# Altium schematic sheet AdcUnit.SchDoc
size A2
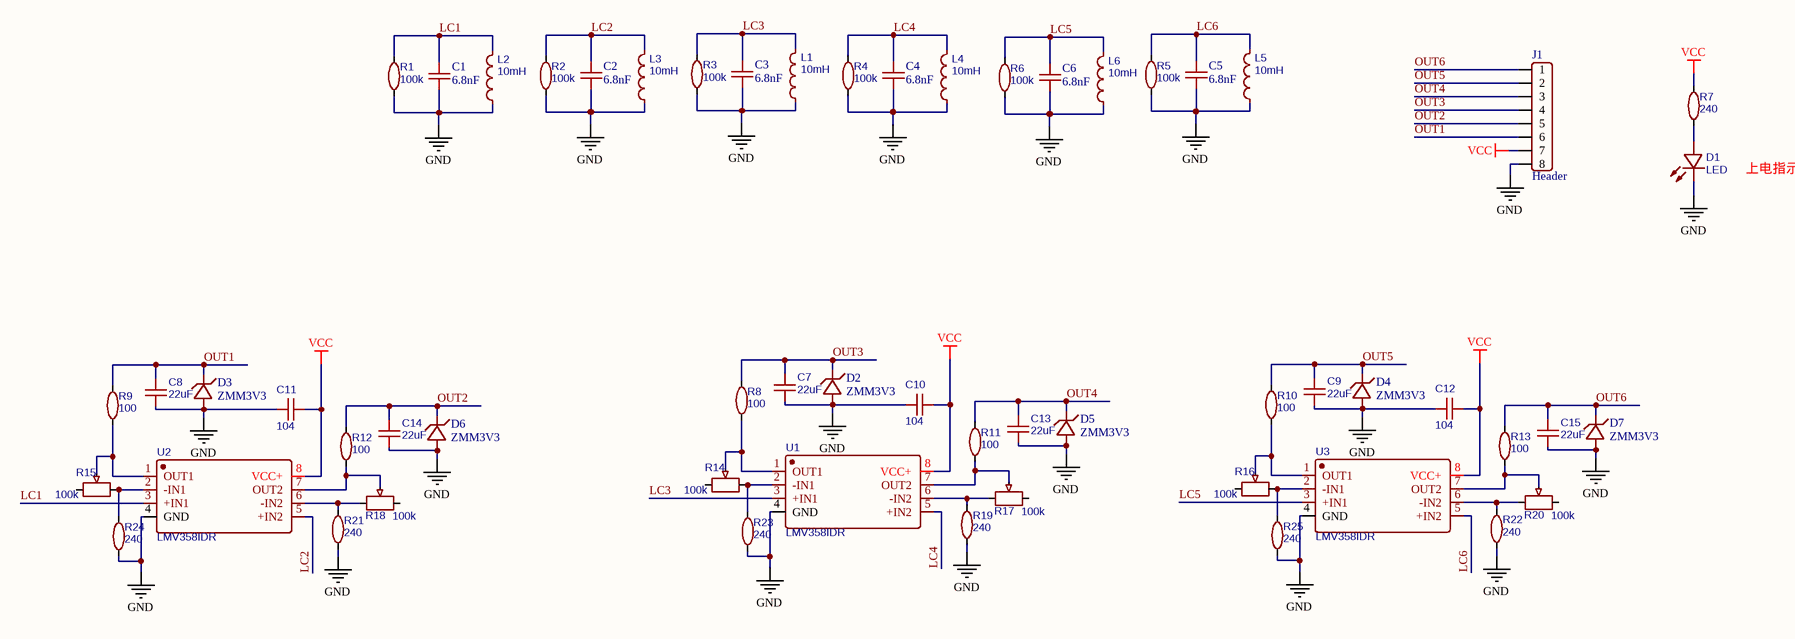
[diagram p0: AdcUnit.SchDoc]

## Parts
C1  6.8nF  [CAP3]
C2  6.8nF  [CAP3]
C3  6.8nF  [CAP3]
C4  6.8nF  [CAP3]
C5  6.8nF  [CAP3]
C6  6.8nF  [CAP3]
C7  22uF  [CAP_0603]
C8  22uF  [CAP_0603]
C9  22uF  [CAP_0603]
C10  104  [CAP_0603]
C11  104  [CAP_0603]
C12  104  [CAP_0603]
C13  22uF  [CAP_0603]
C14  22uF  [CAP_0603]
C15  22uF  [CAP_0603]
D1  LED  [LED_0603_B]
D2  ZMM3V3  [LL34]
D3  ZMM3V3  [LL34]
D4  ZMM3V3  [LL34]
D5  ZMM3V3  [LL34]
D6  ZMM3V3  [LL34]
D7  ZMM3V3  [LL34]
J1  Header  [Header 2.54X8]
L1  10mH  [Inductor_8x10]
L2  10mH  [Inductor_8x10]
L3  10mH  [Inductor_8x10]
L4  10mH  [Inductor_8x10]
L5  10mH  [Inductor_8x10]
L6  10mH  [Inductor_8x10]
R1  100k  [RES_0603]
R2  100k  [RES_0603]
R3  100k  [RES_0603]
R4  100k  [RES_0603]
R5  100k  [RES_0603]
R6  100k  [RES_0603]
R7  240  [RES_0603]
R8  100  [RES_0603]
R9  100  [RES_0603]
R10  100  [RES_0603]
R11  100  [RES_0603]
R12  100  [RES_0603]
R13  100  [RES_0603]
R14  100k  [RES_POT-3296W]
R15  100k  [RES_POT-3296W]
R16  100k  [RES_POT-3296W]
R17  100k  [RES_POT-3296W]
R18  100k  [RES_POT-3296W]
R19  240  [RES_0603]
R20  100k  [RES_POT-3296W]
R21  240  [RES_0603]
R22  240  [RES_0603]
R23  240  [RES_0603]
R24  240  [RES_0603]
R25  240  [RES_0603]
U1  LMV358IDR  [SOIC-8_150MIL]
U2  LMV358IDR  [SOIC-8_150MIL]
U3  LMV358IDR  [SOIC-8_150MIL]

## Nets
GND: C1.2 C2.2 C3.2 C4.2 C5.2 C6.2 C7.2 C8.2 C9.2 C10.1 C11.1 C12.1 C13.2 C14.2 C15.2 D1.C D2.1(A) D3.1(A) D4.1(A) D5.1(A) D6.1(A) D7.1(A) J1.8 L1.1 L2.1 L3.1 L4.1 L5.1 L6.1 R1.1 R2.1 R3.1 R4.1 R5.1 R6.1 R19.1 R21.1 R22.1 R23.1 R24.1 R25.1 U1.4(GND) U2.4(GND) U3.4(GND)
VCC: C10.2 C11.2 C12.2 J1.7 R7.2 U1.8(VCC+) U2.8(VCC+) U3.8(VCC+)
LC1: C1.1 L2.2 R1.2 U2.3(+IN1)
LC2: C2.1 L3.2 R2.2 U2.5(+IN2)
LC3: C3.1 L1.2 R3.2 U1.3(+IN1)
LC4: C4.1 L4.2 R4.2 U1.5(+IN2)
LC5: C6.1 L6.2 R6.2 U3.3(+IN1)
LC6: C5.1 L5.2 R5.2 U3.5(+IN2)
OUT1: C8.1 D3.2(C) J1.6 R9.2
OUT2: C14.1 D6.2(C) J1.5 R12.2
OUT3: C7.1 D2.2(C) J1.4 R8.2
OUT4: C13.1 D5.2(C) J1.3 R11.2
OUT5: C9.1 D4.2(C) J1.2 R10.2
OUT6: C15.1 D7.2(C) J1.1 R13.2
NetD1_A: D1.A R7.1
NetR8_1: R8.1 R14.2 U1.1(OUT1)
NetR9_1: R9.1 R15.2 U2.1(OUT1)
NetR10_1: R10.1 R16.2 U3.1(OUT1)
NetR11_1: R11.1 R17.2 U1.7(OUT2)
NetR12_1: R12.1 R18.2 U2.7(OUT2)
NetR13_1: R13.1 R20.2 U3.7(OUT2)
NetR14_3: R14.3 R23.2 U1.2(-IN1)
NetR15_3: R15.3 R24.2 U2.2(-IN1)
NetR16_3: R16.3 R25.2 U3.2(-IN1)
NetR17_1: R17.1 R19.2 U1.6(-IN2)
NetR18_1: R18.1 R21.2 U2.6(-IN2)
NetR20_1: R20.1 R22.2 U3.6(-IN2)

Not connected (* = marked no-connect by the designer): R14 1; R15 1; R16 1; R17 3; R18 3; R20 3

## Notes on the sheet
- 上电指示

## Library data of the parts
C1-C6 = CAP_聚苯电容
C7-C15 = CAP_0603: BOM_Manufacturer: Samsung Electro-Mechanics; BOM_Manufacturer Part: CL10B104KB8WPNC; nameAlias: Capacitance; Contributor: LCSC; BOM_Supplier: LCSC; BOM_Supplier Part: C307348; spicePre: C; spiceSymbolName: CL10B104KB8WPNC
D1 = LED_0603: 发光LED; BOM_Manufacturer: ARKLED; BOM_Manufacturer Part: D-G080508G1; Contributor: LCSC; BOM_Supplier: LCSC; BOM_Supplier Part: C107402; spicePre: L; spiceSymbolName: D-G080508G1
J1 = Header 2.54_8
L1-L6 = Inductor: BOM_Manufacturer: TDK; BOM_Manufacturer Part: NLV25T-330J-EF; nameAlias: Inductance; Contributor: LCSC; BOM_Supplier: LCSC; BOM_Supplier Part: C295130; spicePre: L; spiceSymbolName: NLV25T-330J-EF
R1-R13 R19 R21-R25 = RES_0603: BOM_Manufacturer: YAGEO; BOM_Manufacturer Part: RC0402JR-07100KL; nameAlias: Resistance (Ohms); BOM_Supplier: LCSC; BOM_Supplier Part: C106234; spicePre: R; spiceSymbolName: RC0402JR-07100KL
R14-R18 R20 = RES_POT-3296W: 可调电阻3296W; BOM_Manufacturer: Chengdu Guosheng Tech; BOM_Manufacturer Part: 3296W-1-104; nameAlias: Resistance (Ohms); Contributor: LCSC; BOM_Supplier: LCSC; BOM_Supplier Part: C118963; Resistance(Ohms): 100K; spicePre: R; spiceSymbolName: 3296W-1-104
U1-U3 = LMV358IDR: BOM_Manufacturer: TI; SMT Type: Extend; BOM_Supplier: LCSC; BOM_Manufacturer Part: LMV358IDR; BOM_Supplier Part: C63813; BOM_LCSC Assembly: Yes; spicePre: U; spiceSymbolName: LMV358IDR